# Altium schematic sheet [02] - Discriminators.SchDoc
size A4; Address1: III. Physikalisches Institut B; Address2: RWTH Aachen University; Address3: Otto-Blumenthal-Strasse; Address4: 52074 Aachen, GERMANY; DocumentNumber: 3; SheetNumber: 3; SheetTotal: 6
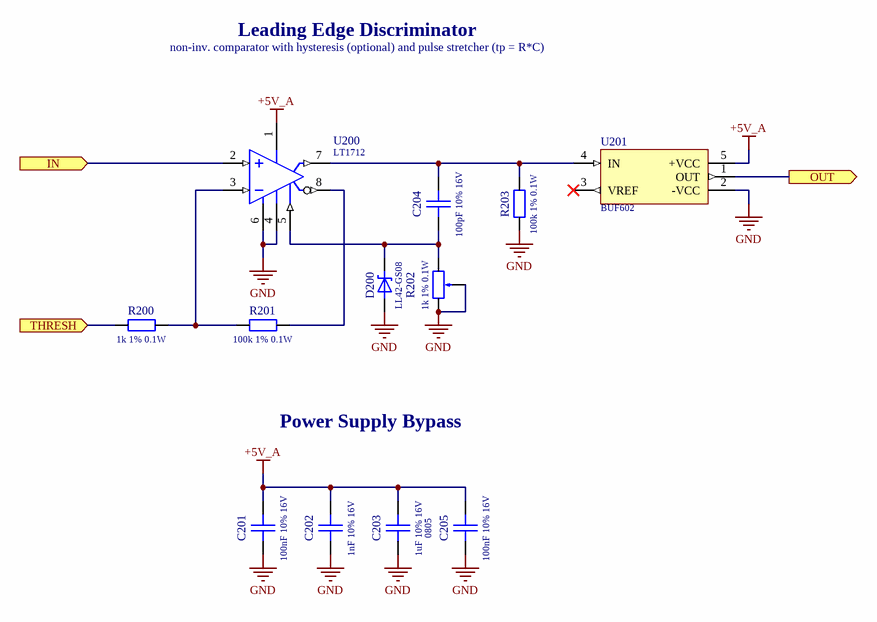
[diagram p0: [02] - Discriminators.SchDoc]

## Parts
C201  100nF 10% 16V  [0603_CAP]
C202  1nF 10% 16V  [0603_CAP]
C203  PackageReference: 0805  [0805_CAP]  (hidden comment: 1uF 10% 16V)
C204  100pF 10% 16V  [0603_CAP]
C205  100nF 10% 16V  [0603_CAP]
D200  LL42-GS08  [MiniMELF]
R200  1k 1% 0.1W  [0603_RES]
R201  100k 1% 0.1W  [0603_RES]
R202  1k 1% 0.1W  [3224W]
R203  100k 1% 0.1W  [0603_RES]
U200  LT1712  [MSOP-8]
U201  BUF602  [SOT-23-5]

## Ports
IN (in), OUT (out), THRESH (in)

## Nets
+5V_A: C201.2 C202.2 C203.2 C205.2 U200.1(+V) U201.5(+VCC)
GND: C201.1 C202.1 C203.1 C205.1 D200.2(A) R202.1(CCW) R202.2(WIPER) R203.2 U200.4(-V) U200.6(GND) U201.2(-VCC)
IN: U200.2(+IN) ; port IN
OUT: U201.1(OUT) ; port OUT
THRESH: R200.2 ; port THRESH
NetC204_1: C204.1 D200.1(K) R202.3(CW) U200.5(LE)
NetC204_2: C204.2 R203.1 U200.7(Q) U201.4(IN)
NetR200_1: R200.1 R201.2 U200.3(-IN)
NetR201_1: R201.1 U200.8(~{Q})

Not connected (* = marked no-connect by the designer): U201 3(VREF)*

## Notes on the sheet
- Leading Edge Discriminator
- non-inv. comparator with hysteresis (optional) and pulse stretcher (tp = R*C)
- Power Supply Bypass
- TITLE
- REVISION
- PROJECT
- AUTHOR
- DESC.
- DATE
- SHEET
- OF

## Library data of the parts
C201-C205 = Capacitor: Simple generic capacitor.
  C201 C205: PackageReference: 0603; Value: 100nF 10% 16V
  C202: PackageReference: 0603; Value: 1nF 10% 16V
  C203: Value: 1uF 10% 16V
  C204: PackageReference: 0603; Value: 100pF 10% 16V
D200 = Schottky Diode: Simple schottky diode.; Manufacturer: Vishay; PackageReference: MiniMELF; PartNumber: LL42-GS08; Value: LL42-GS08
R200 R201 R203 = Resistor: Simple generic resistor.; PackageReference: 0603
  R200: Value: 1k 1% 0.1W
  R201 R203: Value: 100k 1% 0.1W
R202 = Potentiometer: Simple generic potentiometer.; Value: 1k 1% 0.1W
U200 = LT1712: Single/Dual 4.5ns, 3V/5V/±5V, Rail-to-Rail Comparators; Manufacturer: Analog Devices; PartNumber: LT1712CGN; PackageReference: SSOP-16; Supplier1: Digi-Key; Supplier1PartNumber: LT1712CGN#PBF-ND; Supplier1Link: https://www.digikey.de/product-detail/de/linear-technology-analog-devices/LT1712CGN-PBF/LT1712CGN-PBF-ND/961051; Value: LT1712
U201 = BUF602: High-Speed, Closed-Loop Buffer.; Manufacturer: Texas Instruments; PartNumber: BUF602IDBVT; PackageReference: SOT-23-5; Value: BUF602